# EAGLE design PogoBoard (EAGLE 6.6.0)
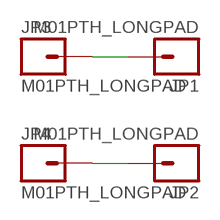
[diagram p0: schematic, sheet 1]

## Parts
JP1  M01PTH_LONGPAD  [1X01_LONGPAD]
JP2  M01PTH_LONGPAD  [1X01_LONGPAD]
JP3  M01PTH_LONGPAD  [1X01_LONGPAD]
JP4  M01PTH_LONGPAD  [1X01_LONGPAD]

## Nets
GND: JP1.1 JP3.1
VSOLAR: JP2.1 JP4.1

## Library data of the parts
JP1-JP4 = SparkFun:M01: Header 1 Standard 1-pin 0.1" header. Use with straight break away headers (SKU : PRT-00116), right angle break away headers (PRT-00553), swiss pins (PRT-00743), machine pins (PRT-00117), and female headers (PRT-00115).

## Board
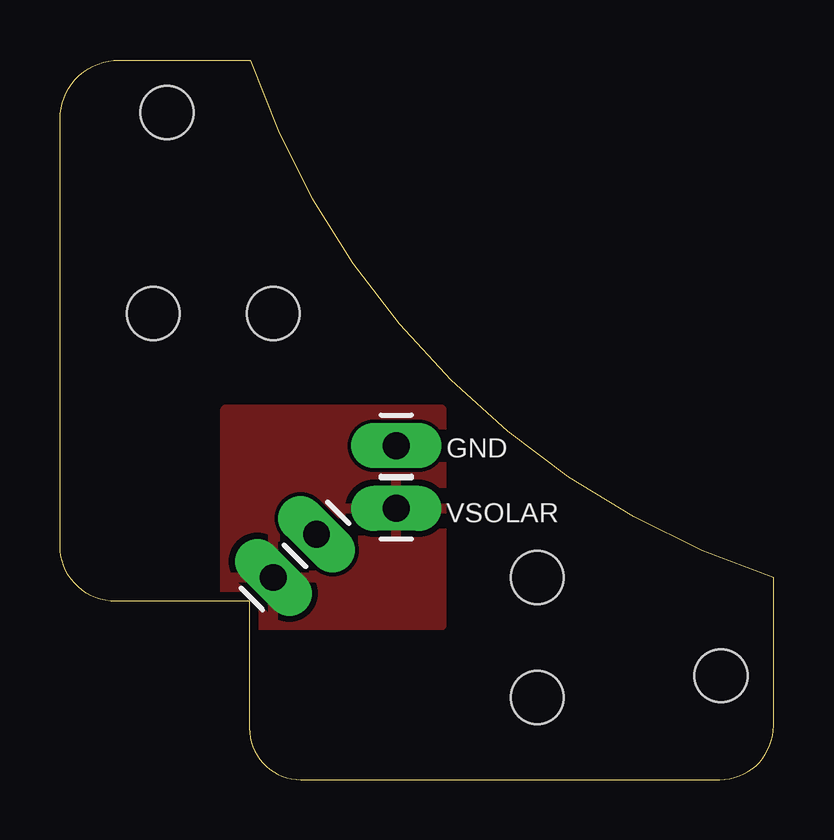
[diagram p1: board, top side]
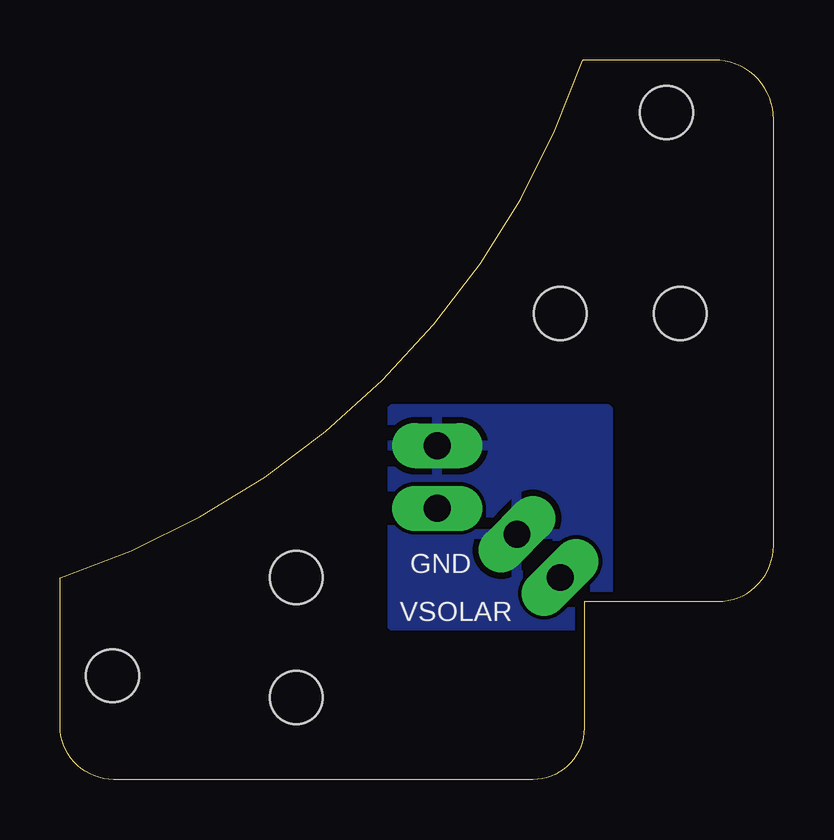
[diagram p2: board, bottom side, seen from below]

Size 29.73 x 29.98 mm. Coordinates in mm from the lower left corner, seen from the top.
Outline: 7.89,7.42 2.32,7.42 arc-90 0,9.74 0,27.51 arc-90 2.47,29.98 7.95,29.98 arc53 29.73,8.41 29.73,2.24 arc-90 27.49,0 10.03,0 arc-90 7.89,2.14 7.89,7.42
Copper layers (1*16): Top 0.0356mm / dielectric 1.5011mm / Bottom 0.0356mm
Design rules "OSHPark-2layer": minimum track width 6mil, minimum drill 13mil, track to track 6mil, track to pad 6mil, pad to pad 6mil, via to via 6mil, smd to smd 6mil, copper to edge 15mil, drill to drill 6mil, minimum pad ring 7mil, minimum via ring 7mil, stop-mask expansion 4mil, vias tented up to drill 0mil, thermal gap 10mil
Holes 2.2 mm at 4.46,27.79 27.54,4.32 3.89,19.42 8.89,19.42 19.89,3.42 19.89,8.42

### Footprints (pad centres in the part's own frame; a part is rotated, then mirrored left to right if it is on the bottom)
1X01_LONGPAD = drill 1.118 pad 1.88 long: 1 0,0

### Placement (x,y rotation side)
JP1  14.01,13.91 90 top
JP2  14.01,11.3 90 top
JP3  10.69,10.22 225 top
JP4  8.89,8.42 225 top

### Tracks (layer width: path | path; a pad name or v marks a point on that pad's centre or on a via)
GND
  pour Bottom: 6.89,7.42 6.89,15.42 15.89,15.42 15.89,6.42 7.89,6.42 7.89,7.42
VSOLAR
  pour Top: 6.89,7.42 6.89,15.42 15.89,15.42 15.89,6.42 7.89,6.42 7.89,7.42

### Text on the board
tPlace: GND | VSOLAR
bPlace: GND | VSOLAR